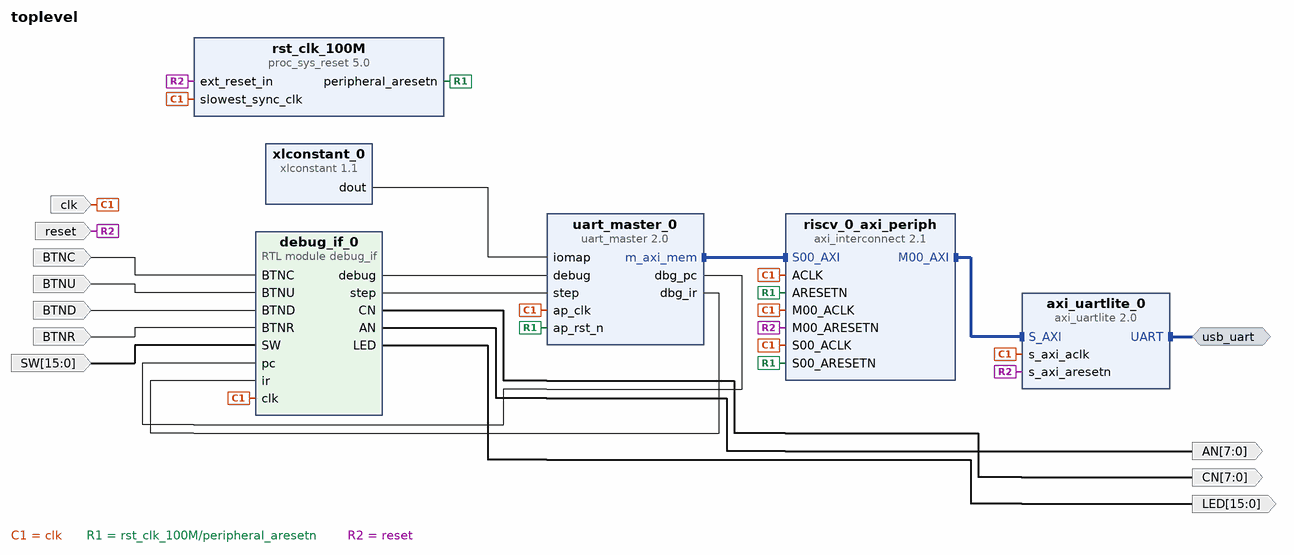
[diagram p0: block diagram of the top level]
# Vivado block design toplevel, xc7a100tcsg324-1, Vivado 2020.1
create_bd_design toplevel

create_bd_intf_port -mode Master -vlnv xilinx.com:interface:uart_rtl:1.0 usb_uart
create_bd_port -dir O -from 15 -to 0 -type data LED
create_bd_port -dir I -from 15 -to 0 SW
create_bd_port -dir I BTNC
create_bd_port -dir I BTNU
create_bd_port -dir I BTND
create_bd_port -dir I -type clk clk
set_property -dict {CONFIG.FREQ_HZ 100000000} [get_bd_ports clk]
create_bd_port -dir O -from 7 -to 0 CN
create_bd_port -dir O -from 7 -to 0 AN
create_bd_port -dir I -type rst reset
set_property -dict {CONFIG.POLARITY ACTIVE_LOW} [get_bd_ports reset]
create_bd_port -dir I BTNR

create_bd_cell -type ip -vlnv xilinx.com:ip:axi_uartlite:2.0 axi_uartlite_0
set_property -dict [list \
  CONFIG.C_BAUDRATE 115200 \
  CONFIG.UARTLITE_BOARD_INTERFACE usb_uart \
  CONFIG.USE_BOARD_FLOW true \
] [get_bd_cells axi_uartlite_0]
create_bd_cell -type ip -vlnv xilinx.com:ip:axi_interconnect:2.1 riscv_0_axi_periph
set_property -dict {CONFIG.NUM_MI 1} [get_bd_cells riscv_0_axi_periph]
create_bd_cell -type ip -vlnv xilinx.com:ip:proc_sys_reset:5.0 rst_clk_100M
set_property -dict {CONFIG.RESET_BOARD_INTERFACE reset CONFIG.USE_BOARD_FLOW true} [get_bd_cells rst_clk_100M]
create_bd_cell -type ip -vlnv xilinx.com:ip:xlconstant:1.1 xlconstant_0
set_property -dict {CONFIG.CONST_VAL 0 CONFIG.CONST_WIDTH 32} [get_bd_cells xlconstant_0]
create_bd_cell -type module -reference debug_if debug_if_0
create_bd_cell -type ip -vlnv xilinx.com:hls:uart_master:2.0 uart_master_0

# ---- connections ----

connect_bd_intf_net [get_bd_intf_ports usb_uart] [get_bd_intf_pins axi_uartlite_0/UART]
connect_bd_intf_net [get_bd_intf_pins riscv_0_axi_periph/M00_AXI] [get_bd_intf_pins axi_uartlite_0/S_AXI]
connect_bd_intf_net [get_bd_intf_pins uart_master_0/m_axi_mem] [get_bd_intf_pins riscv_0_axi_periph/S00_AXI]
connect_bd_net [get_bd_ports clk] \
  [get_bd_pins riscv_0_axi_periph/S00_ACLK] [get_bd_pins rst_clk_100M/slowest_sync_clk] \
  [get_bd_pins axi_uartlite_0/s_axi_aclk] [get_bd_pins riscv_0_axi_periph/M00_ACLK] [get_bd_pins riscv_0_axi_periph/ACLK] \
  [get_bd_pins debug_if_0/clk] [get_bd_pins uart_master_0/ap_clk]
connect_bd_net [get_bd_pins rst_clk_100M/peripheral_aresetn] \
  [get_bd_pins riscv_0_axi_periph/S00_ARESETN] [get_bd_pins riscv_0_axi_periph/ARESETN] [get_bd_pins uart_master_0/ap_rst_n]
connect_bd_net [get_bd_ports reset] \
  [get_bd_pins rst_clk_100M/ext_reset_in] [get_bd_pins axi_uartlite_0/s_axi_aresetn] \
  [get_bd_pins riscv_0_axi_periph/M00_ARESETN]
connect_bd_net [get_bd_pins debug_if_0/CN] [get_bd_ports CN]
connect_bd_net [get_bd_pins debug_if_0/AN] [get_bd_ports AN]
connect_bd_net [get_bd_pins debug_if_0/LED] [get_bd_ports LED]
connect_bd_net [get_bd_ports BTNC] [get_bd_pins debug_if_0/BTNC]
connect_bd_net [get_bd_ports BTNU] [get_bd_pins debug_if_0/BTNU]
connect_bd_net [get_bd_ports BTND] [get_bd_pins debug_if_0/BTND]
connect_bd_net [get_bd_ports BTNR] [get_bd_pins debug_if_0/BTNR]
connect_bd_net [get_bd_ports SW] [get_bd_pins debug_if_0/SW]
connect_bd_net [get_bd_pins debug_if_0/debug] [get_bd_pins uart_master_0/debug]
connect_bd_net [get_bd_pins debug_if_0/step] [get_bd_pins uart_master_0/step]
connect_bd_net [get_bd_pins xlconstant_0/dout] [get_bd_pins uart_master_0/iomap]
connect_bd_net [get_bd_pins uart_master_0/dbg_pc] [get_bd_pins debug_if_0/pc]
connect_bd_net [get_bd_pins uart_master_0/dbg_ir] [get_bd_pins debug_if_0/ir]

# ---- address map ----
assign_bd_address -offset 0x00000000 -range 64K -target_address_space [get_bd_addr_spaces uart_master_0/Data_m_axi_mem] [get_bd_addr_segs axi_uartlite_0/S_AXI/Reg]

validate_bd_design
save_bd_design
